# Altium schematic sheet DCBLOCKx1DIFF.SchDoc
size A3
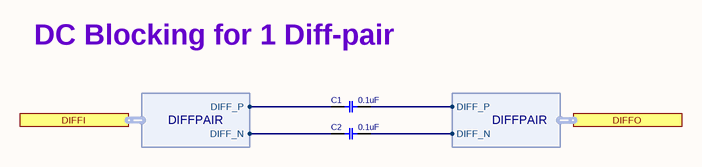
[diagram p0: DCBLOCKx1DIFF.SchDoc]

## Parts
C1  0.1uF  [C0402]
C2  0.1uF  [C0402]

## Ports
DIFFI (harness DIFFPAIR), DIFFO (harness DIFFPAIR)

## Harnesses
DIFFPAIR: DIFF_N, DIFF_P

## Nets
NetC1_1: C1.1 ; port DIFFI.DIFF_P
NetC1_2: C1.2 ; port DIFFO.DIFF_P
NetC2_1: C2.1 ; port DIFFI.DIFF_N
NetC2_2: C2.2 ; port DIFFO.DIFF_N

## Notes on the sheet
- DC Blocking for 1 Diff-pair
- Title
- Size:
- Date:
- A3
- Number:
- Time:
- Revision:
- Sheet
- of
- File:

## Library data of the parts
C1 C2 = CAP_SMD_MLCC_100n50TDK: CAP, MLCC, 100nF, 50V, X7R, 10%, 0402C; PARAM: X7R, 10%, -55~125oC; MANF_P#: GCM155R71H104KE02D; MANF: Murata; PARAM2: 50V; ASSEMBLY: ASSEMBLY; PRICE: 100= 4$; VALUE: 0.1uF